# EasyEDA Pro project uicd.eprj, schematic UICD

## Sheets
1 Microcontroller: Board Name: UICD; Create Date: 2025-08-20; Page Name: Microcontroller; Project Name: uicd; Schematic Name: UICD; Update Date: 2025-09-17; Add into BOM: yes; Company: ООО "Центр ИКТ"; Convert to PCB: yes; Date: 06.10.2025; Draw By: varion drakonov & another; REV: 1.2; Sheet: 1/1; spicePre: .
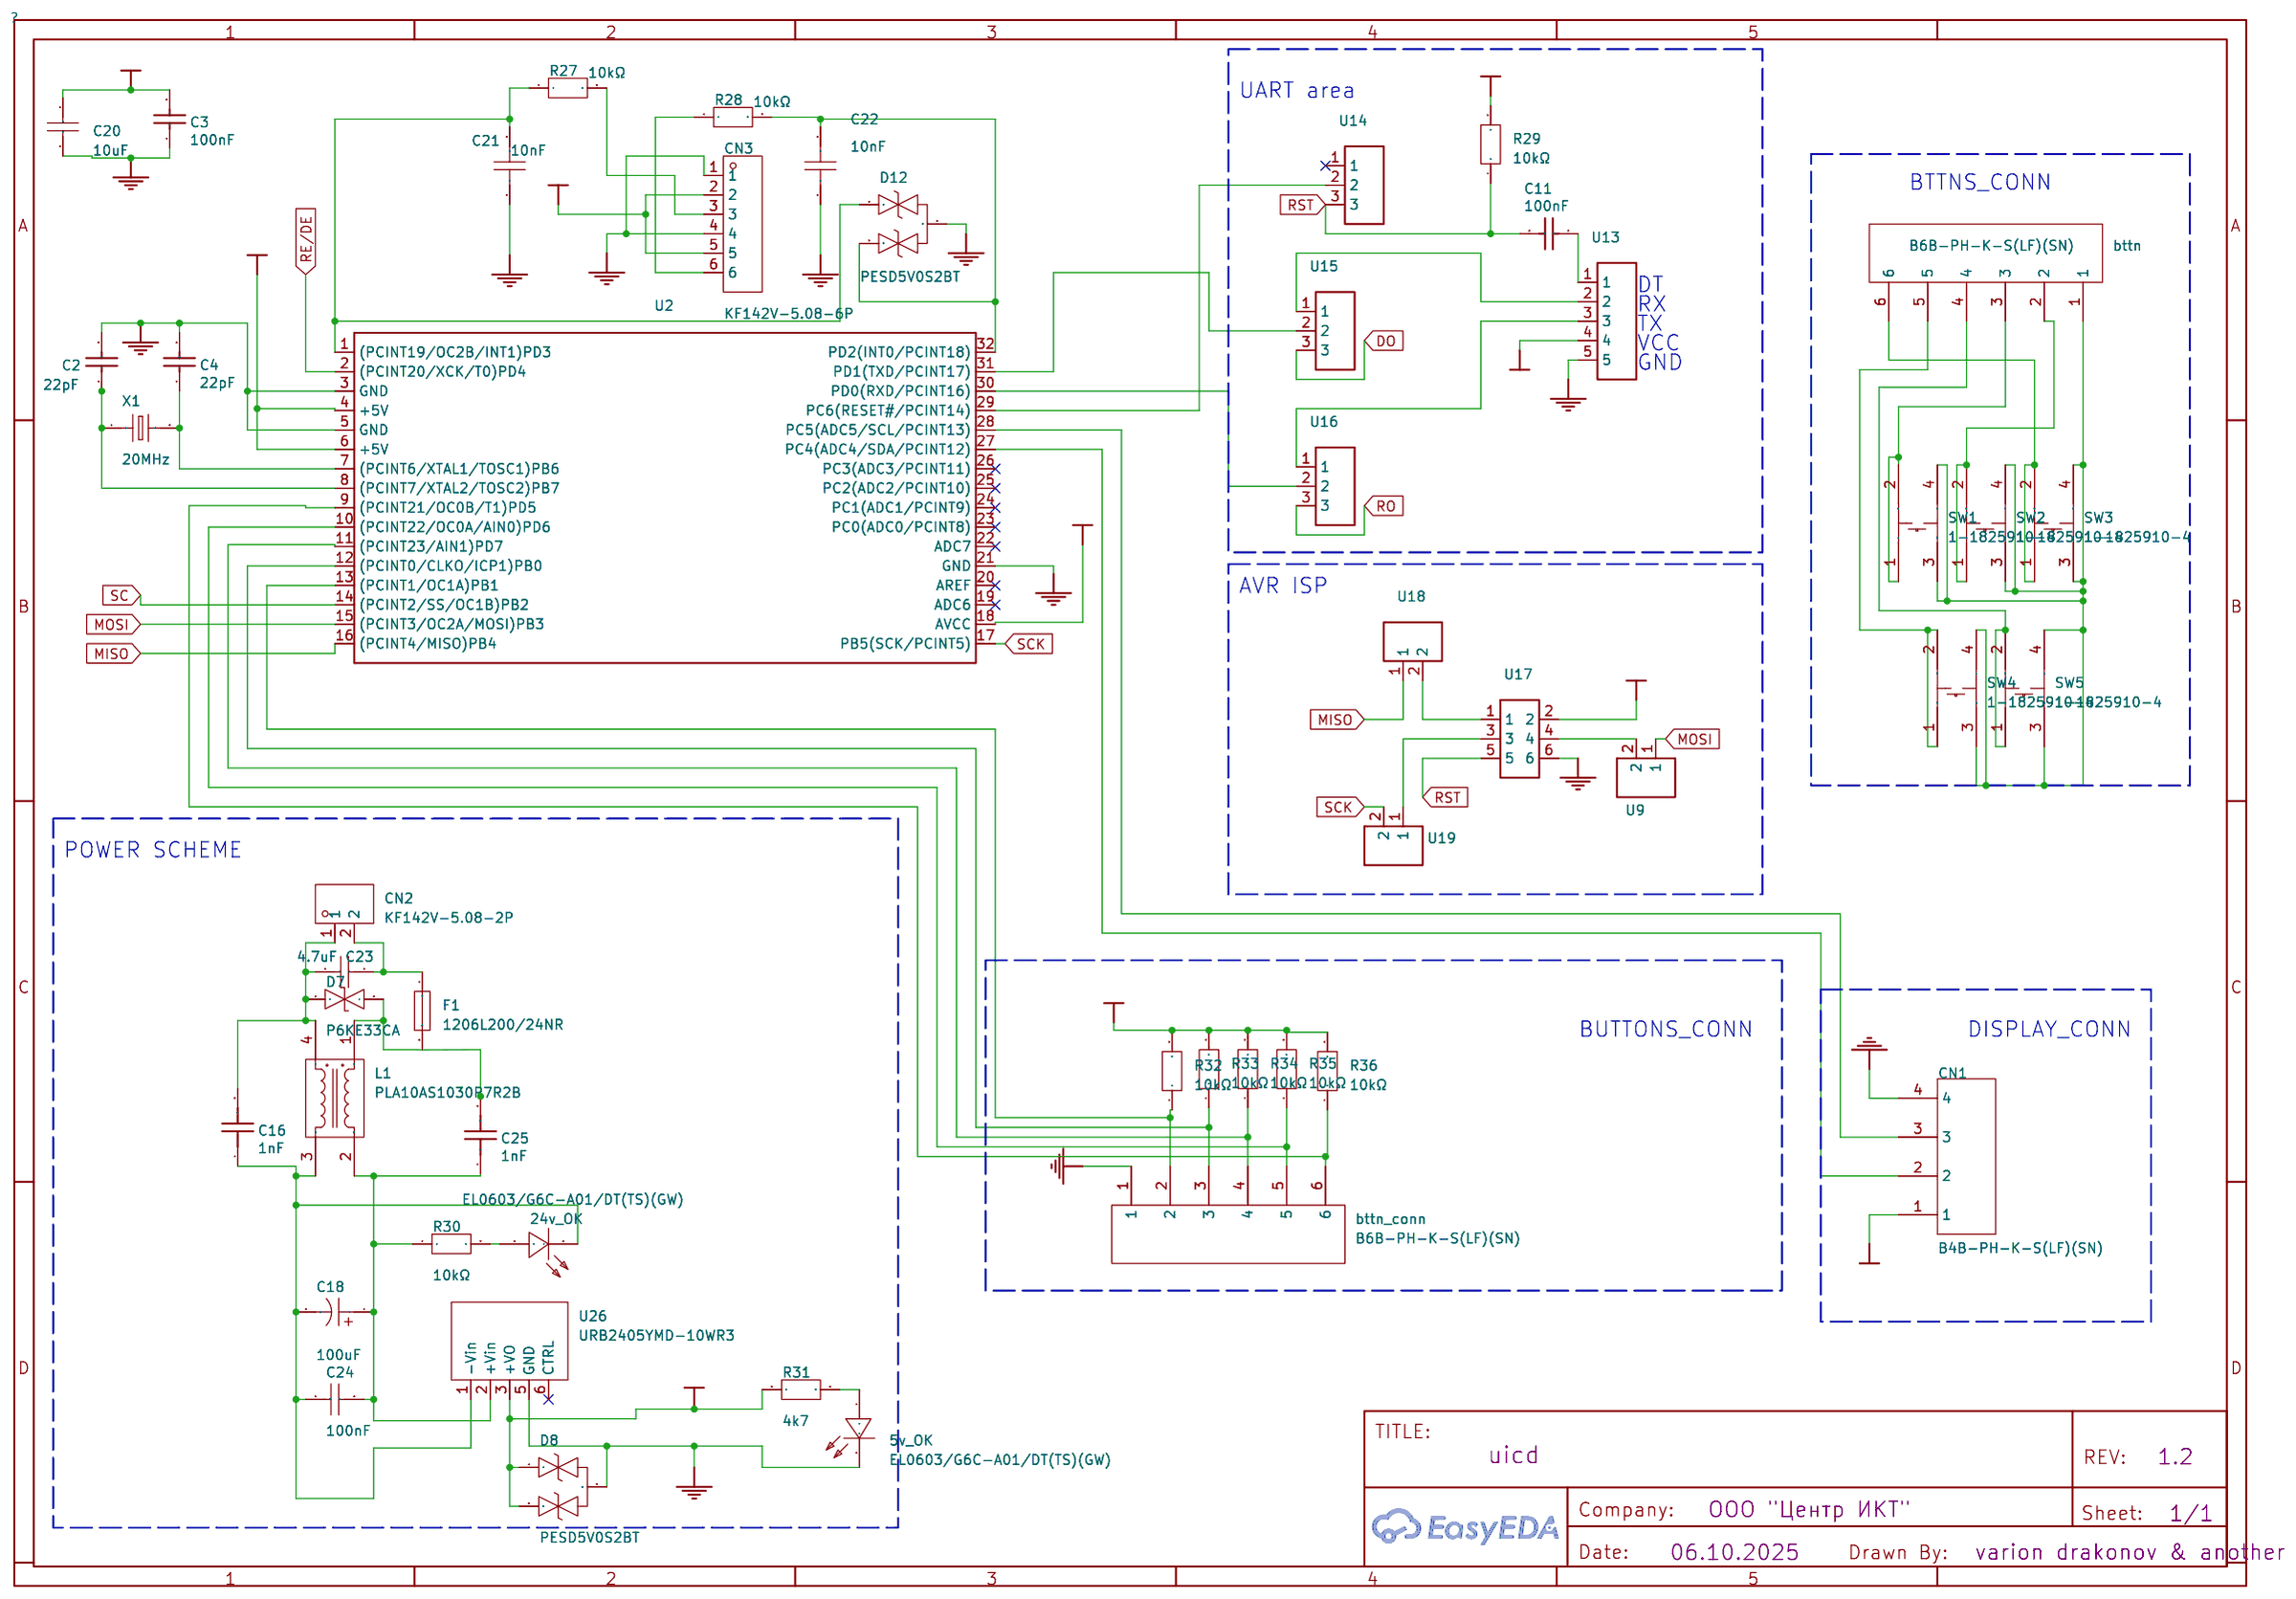
[diagram p0: Microcontroller]
2 MicroSD: Page Name: MicroSD; Update Date: 2025-09-04
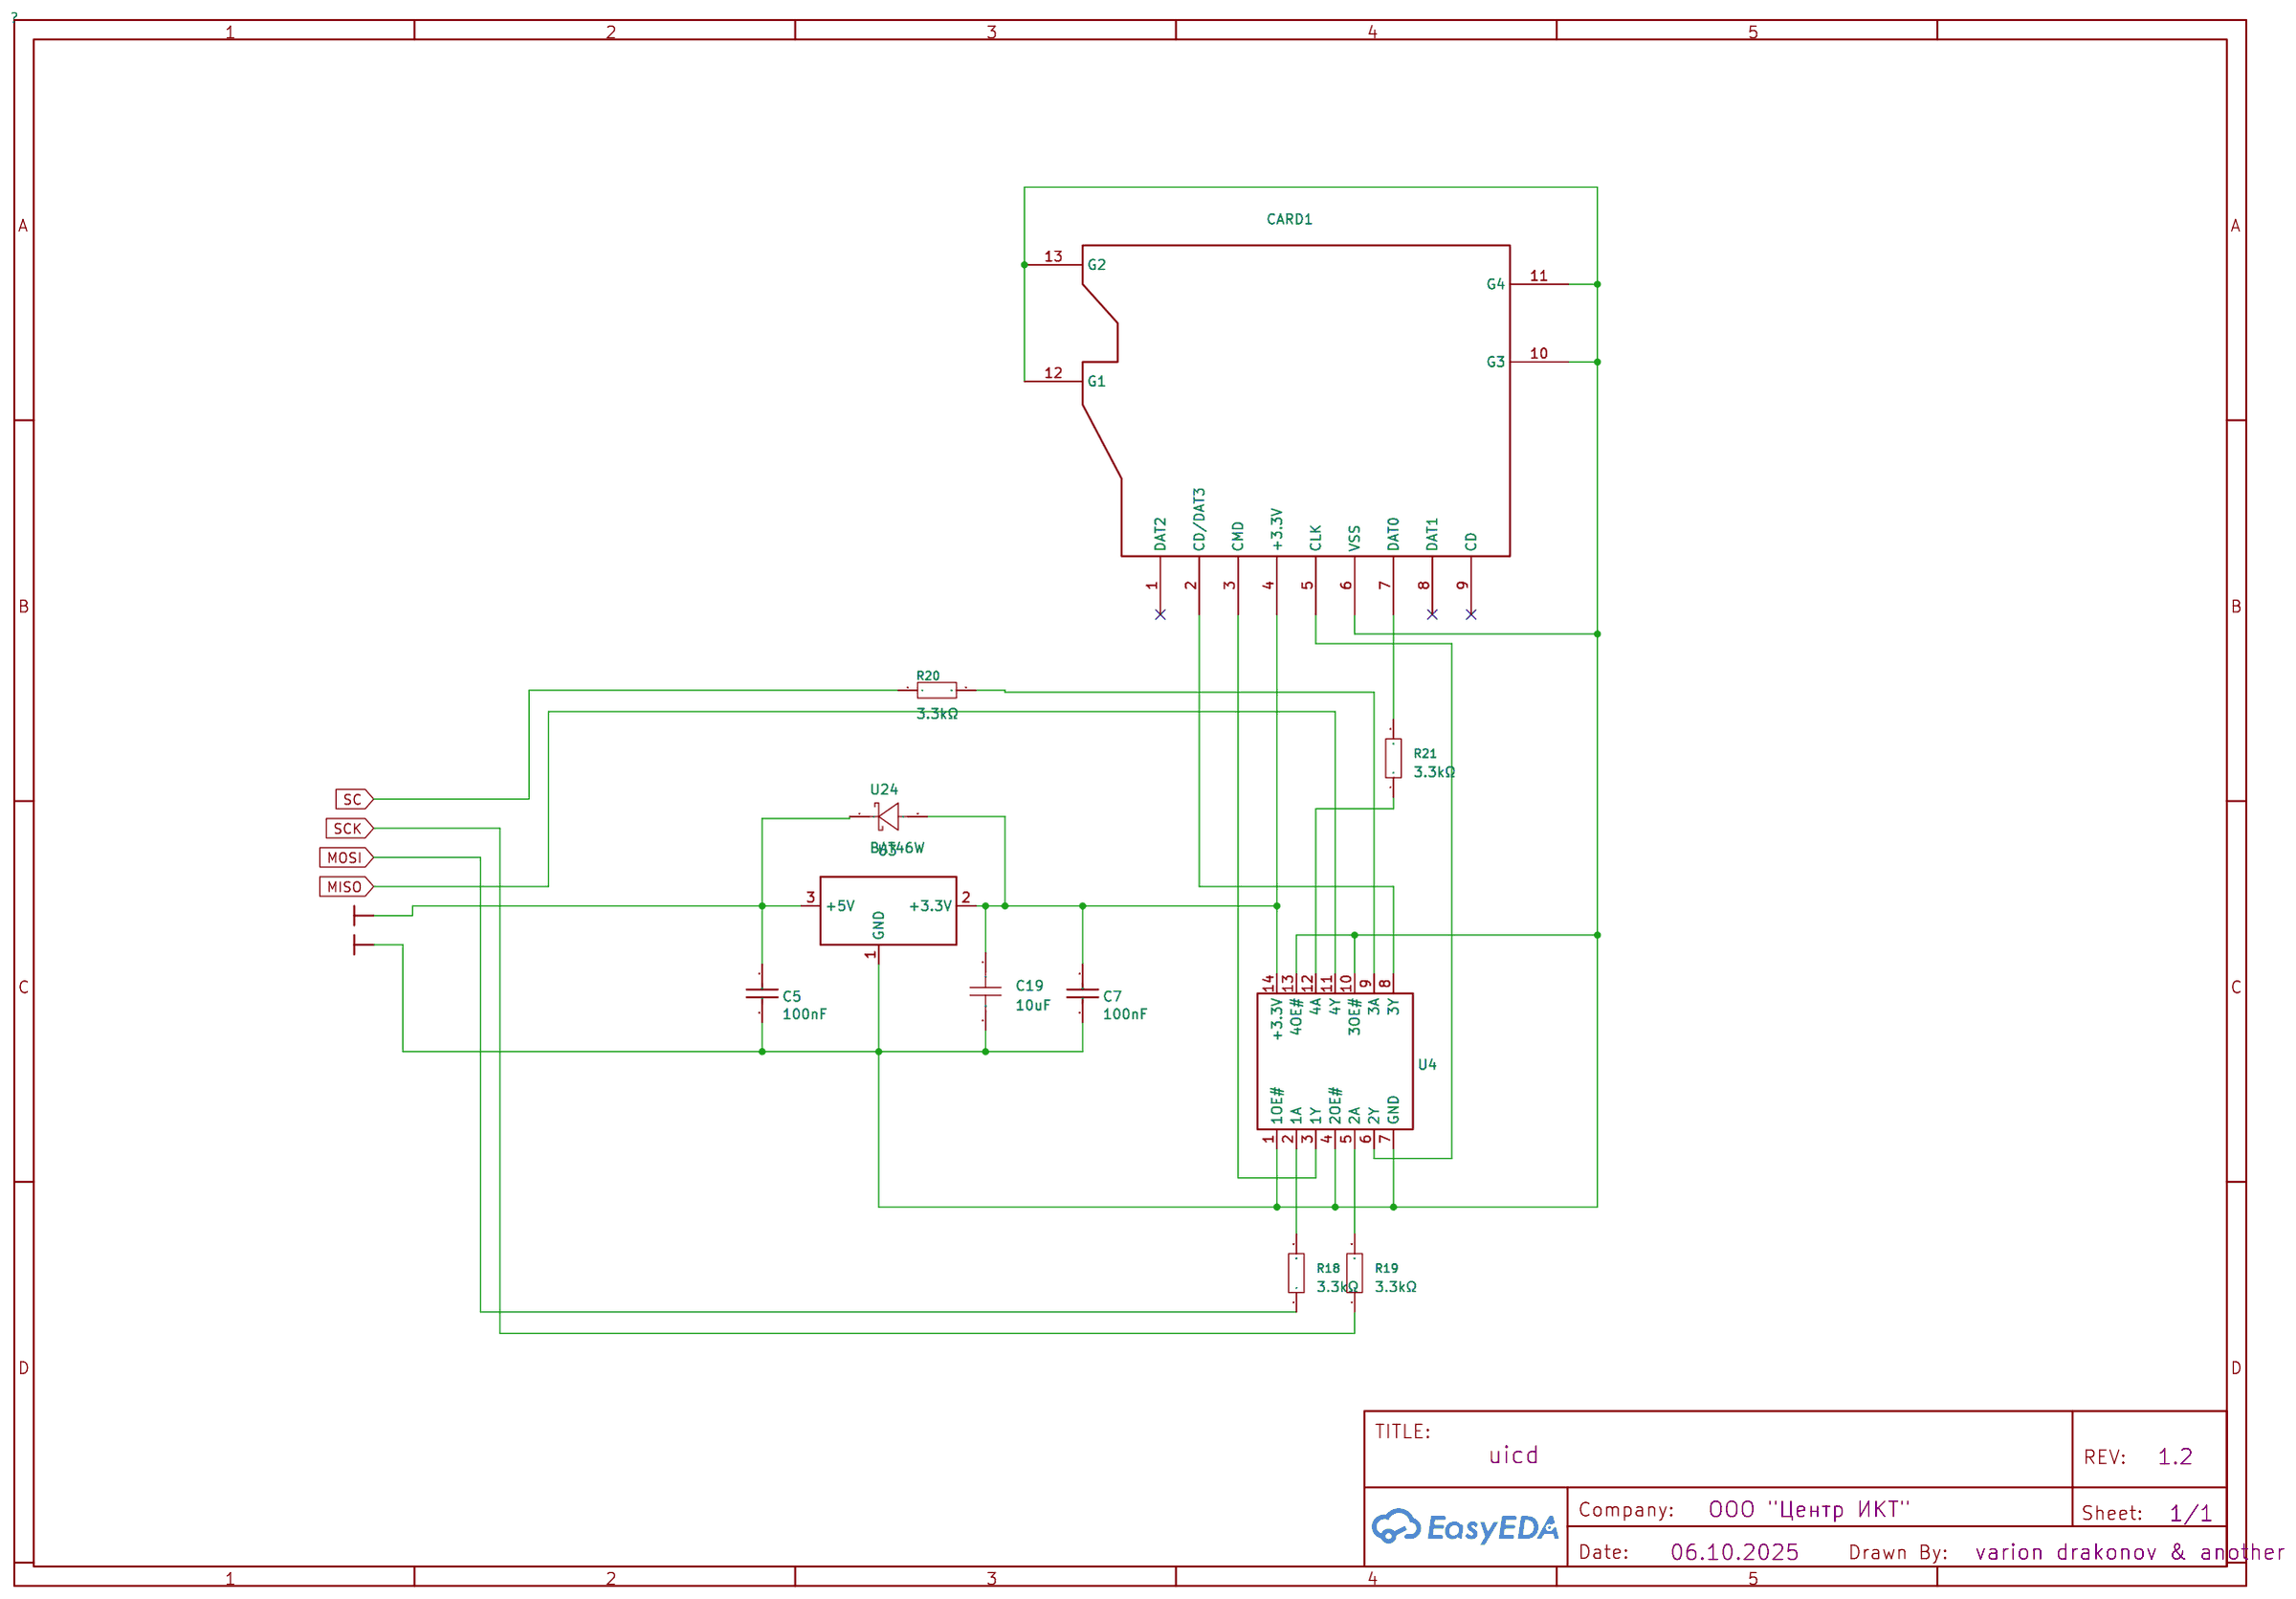
[diagram p1: MicroSD]
3 RS-485: Page Name: RS-485
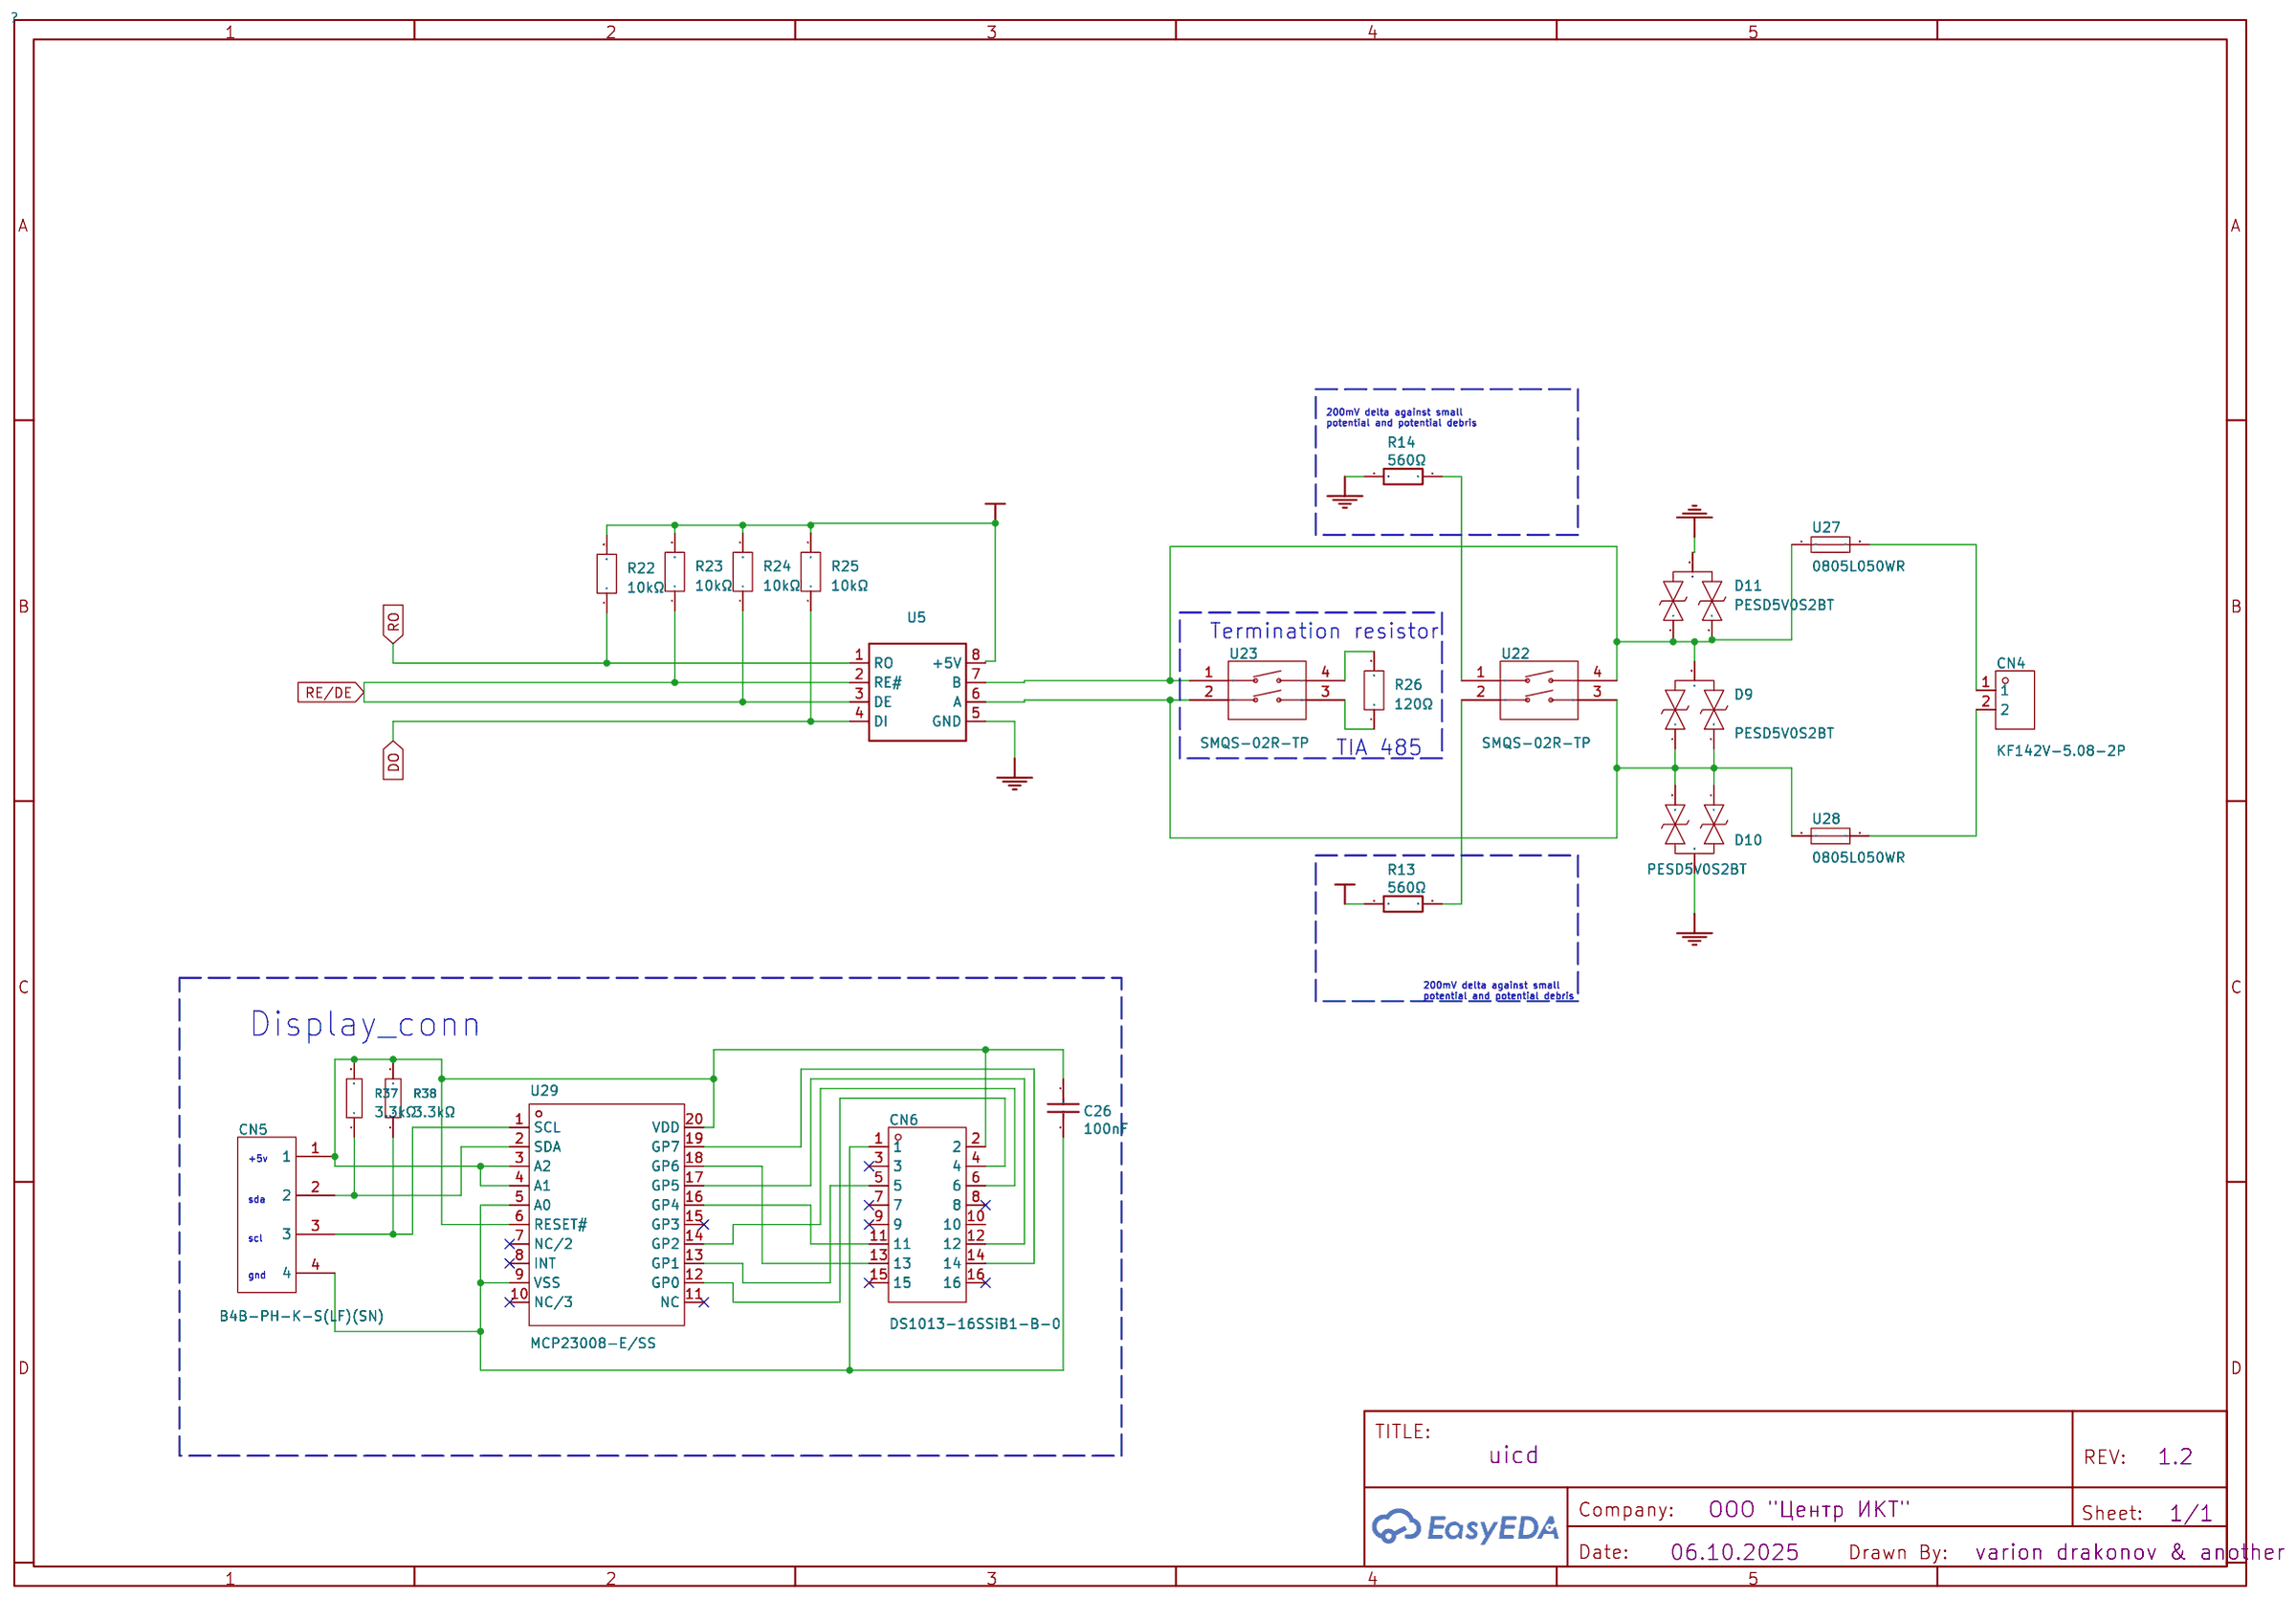
[diagram p2: RS-485]

## Parts
sheet Microcontroller
5v_OK  EL0603/G6C-A01/DT(TS)(GW)  [LED0603-R-RD_GREEN]
24v_OK  EL0603/G6C-A01/DT(TS)(GW)  [LED0603-R-RD_GREEN]
bttn  B6B-PH-K-S(LF)(SN)  [CONN-TH_B6B-PH-K-S]
bttn_conn  B6B-PH-K-S(LF)(SN)  [CONN-TH_B6B-PH-K-S]
C2  22pF  [C0603]
C3  100nF  [C0603]
C4  22pF  [C0603]
C11  100nF  [C0603]
C16  1nF  [C1206]
C18  100uF  [CAP-TH_BD8.0-P3.50-D0.5-FD]
C20  10uF  [C0603]
C21  10nF  [C0603]
C22  10nF  [C0603]
C23  4.7uF  [C1206]
C24  100nF  [C0603]
C25  1nF  [C1206]
CN1  B4B-PH-K-S(LF)(SN)  [CONN-TH_B4B-PH-K-S]
CN2  KF142V-5.08-2P  [CONN-TH_P5.08_KF142V-5.08-2P]
CN3  KF142V-5.08-6P  [CONN-TH_6P-P5.08_KF142V-5.08-6P]
D7  P6KE33CA  [DO-15_BD3.1-L6.7-P10.70-D0.9-BI]
D8  PESD5V0S2BT  [SOT-23-3_L2.9-W1.3-P1.90-LS2.4-BR]
D12  PESD5V0S2BT  [SOT-23-3_L2.9-W1.3-P1.90-LS2.4-BR]
F1  1206L200/24NR  [F1206]
L1  PLA10AS1030R7R2B  [FILTER-TH_PLA10AS1030R7R2B]
R27  10kΩ  [R0603]
R28  10kΩ  [R0603]
R29  10kΩ  [R0603]
R30  10kΩ  [R0603]
R31  4k7  [R0603]
R32  10kΩ  [R0603]
R33  10kΩ  [R0603]
R34  10kΩ  [R0603]
R35  10kΩ  [R0603]
R36  10kΩ  [R0603]
SW1  1-1825910-4  [KEY-TH_4P-L6.0-W6.0-P4.50-LS7.5]
SW2  1-1825910-4  [KEY-TH_4P-L6.0-W6.0-P4.50-LS7.5]
SW3  1-1825910-4  [KEY-TH_4P-L6.0-W6.0-P4.50-LS7.5]
SW4  1-1825910-4  [KEY-TH_4P-L6.0-W6.0-P4.50-LS7.5]
SW5  1-1825910-4  [KEY-TH_4P-L6.0-W6.0-P4.50-LS7.5]
U2  ATMEGA328-AU  [TQFP-32_L7.0-W7.0-P0.80-LS9.0-BL]
U9  DS1021-1x2SF11-B  [HDR-TH_2P-P2.54-V-M]
U13  DS1021-1x5SF11-B  [HDR-TH_5P-P2.54-V-M]
U14  DS1021-1x3SF11-B  [HDR-TH_3P-P2.54-V-M]
U15  DS1021-1x3SF11-B  [HDR-TH_3P-P2.54-V-M]
U16  DS1021-1x3SF11-B  [HDR-TH_3P-P2.54-V-M]
U17  DS1021-2x3SF11-B  [HDR-TH_6P-P2.54-V-M-R2-C3-S2.54]
U18  DS1021-1x2SF11-B  [HDR-TH_2P-P2.54-V-M]
U19  DS1021-1x2SF11-B  [HDR-TH_2P-P2.54-V-M]
U26  URB2405YMD-10WR3  [PWRM-TH_HI-LINK_URXXYMD-XXWR3]
X1  20MHz  [HC-49US_L11.5-W4.5-P4.88]
sheet MicroSD
C5  100nF  [C0603]
C7  100nF  [C0603]
C19  10uF  [C0603]
CARD1  TF-15x15  [TF-SMD_TF-15-15]
R18  3.3kΩ  [R0603]
R19  3.3kΩ  [R0603]
R20  3.3kΩ  [R0603]
R21  3.3kΩ  [R0603]
U3  AMS1117-3.3  [SOT-223-3_L6.5-W3.4-P2.30-LS7.0-BR-1]
U4  AIP74HC125  [SOP-14_L8.6-W3.9-P1.27-LS6.0-BL]
U24  BAT46W  [SOD-123_L2.8-W1.6-LS3.7-RD]
sheet RS-485
C26  100nF  [C0603]
CN4  KF142V-5.08-2P  [CONN-TH_P5.08_KF142V-5.08-2P]
CN5  B4B-PH-K-S(LF)(SN)  [CONN-TH_B4B-PH-K-S]
CN6  DS1013-16SSiB1-B-0  [IDC-TH_16P-P2.54_C3406]
D9  PESD5V0S2BT  [SOT-23-3_L2.9-W1.3-P1.90-LS2.4-BR]
D10  PESD5V0S2BT  [SOT-23-3_L2.9-W1.3-P1.90-LS2.4-BR]
D11  PESD5V0S2BT  [SOT-23-3_L2.9-W1.3-P1.90-LS2.4-BR]
R13  560Ω  [R0603]
R14  560Ω  [R0603]
R22  10kΩ  [R0603]
R23  10kΩ  [R0603]
R24  10kΩ  [R0603]
R25  10kΩ  [R0603]
R26  120Ω  [R0603]
R37  3.3kΩ  [R0603]
R38  3.3kΩ  [R0603]
U5  MAX485CSA+  [SOIC-8_L4.9-W3.9-P1.27-LS6.0-BL]
U22  SMQS-02R-TP  [SW-TH_4P-L9.9-W6.8-P7.62-BL]
U23  SMQS-02R-TP  [SW-TH_4P-L9.9-W6.8-P7.62-BL]
U27  0805L050WR  [R0805]
U28  0805L050WR  [R0805]
U29  MCP23008-E/SS  [SSOP-20_L7.2-W5.3-P0.65-LS7.8-BL]

## Library data of the parts
5v_OK 24v_OK = EL0603/G6C-A01/DT(TS)(GW): LCSC Part Name: 普绿/黄绿; Supplier Part: C1322294; Manufacturer: EVERLIGHT(亿光); Supplier Footprint: 0603; JLCPCB Part Class: Extended Part; Datasheet: https://atta.szlcsc.com/upload/public/pdf/source/20201221/C1322294_C0D439717A258E4D616F938F90961D42.pdf; Supplier: LCSC; Emitted Color: Yellow Green
bttn bttn_conn = B6B-PH-K-S(LF)(SN)_C131342: LCSC Part Name: 1x6P 间距:2mm 直插 系列:PH; Supplier Part: C131342; Manufacturer: JST; Supplier Footprint: 插件,P=2mm; JLCPCB Part Class: Extended Part; Datasheet: https://item.szlcsc.com/datasheet/B6B-PH-K-S(LF)(SN)/142635.html; Supplier: LCSC; Pins Structure: 1x6P; Pitch: 2mm; Mounting Type: Through Hole; Reference Series: PH; Number of Pins: 6P; Number of Rows: 1; Number of PINs Per Row: 6; Current Rating: 2A; Contact Material: Brass; Contact Plating: Tin; Operating Temperature: -25℃~+85℃; Voltage Rating: 100V; Plastic Material: PA66; Flame Retardant Rating: UL94V-0; Supplementary Features: K Pin; Color: White; Z-Height of the Board: 6mm; X-Length of Bottom Edge on Board (Spacing Line): 13.9mm; Y-Width of Bottom Edge on Board: 4.5mm
C2 C4 = 22pF: Supplier: LCSC; Manufacturer: muRata(村田); Manufacturer Part: GRM1555C1H220JA01D; Supplier Part: C76960; JLCPCB Part Class: Extended Part; nameAlias: Value; spicePre: C; spiceSymbolName: GRM188R71C104KA01D
C3 C7 C26 = CC0603KRX7R9BB104: Capacitance:100nF Tolerance:±10% Tolerance:±10% Voltage Rating:50V Temperature Coefficient:X7R; LCSC Part Name: 100nF ±10% 50V; Supplier Part: C14663; Manufacturer: YAGEO(国巨); Supplier Footprint: 0603; JLCPCB Part Class: Basic Part; Datasheet: https://item.szlcsc.com/datasheet/CC0603KRX7R9BB104/15331.html; Supplier: LCSC; Tolerance: ±10%; Voltage Rating: 50V; Temperature Coefficient: X7R
C11 = 0603F104M250: Capacitance:100nF Tolerance:±20% Tolerance:±20% Voltage Rating:25V Temperature Coefficient:Y5V; LCSC Part Name: 100nF ±20% 25V; Supplier Part: C125840; Manufacturer: Walsin(华新科); Supplier Footprint: 0603; JLCPCB Part Class: Extended Part; Datasheet: https://atta.szlcsc.com/upload/public/pdf/source/20191217/C469650_84AD5C6F618CF4AC0C6D987F2E8FE6F8.pdf; Supplier: LCSC; Tolerance: ±20%; Voltage Rating: 25V; Temperature Coefficient: Y5V
C16 C25 = 1206B102K202NT: Capacitance:1000pF Tolerance:±10% Tolerance:±10% Voltage Rating:2000V Temperature Coefficient:X7R; LCSC Part Name: 1nF ±10% 2kV; Supplier Part: C9196; Manufacturer: FH(风华); Supplier Footprint: 1206; JLCPCB Part Class: Basic Part; Datasheet: https://atta.szlcsc.com/upload/public/pdf/source/20200305/C486355_26A10D38EF8C2A5C37091D0039909270.pdf; Supplier: LCSC; Tolerance: ±10%; Voltage Rating: 2000V; Temperature Coefficient: X7R
C18 = 100UF50VF120GF: LCSC Part Name: 100uF ±20% 50V; Supplier Part: C46867072; Manufacturer: Econd(米朗电子); Supplier Footprint: 插件,D8xL12mm; Datasheet: https://atta.szlcsc.com/upload/public/pdf/source/20250321/B9ED006D79D4CBB252CF6B54793BD6AA.pdf; Supplier: LCSC; Tolerance: ±20%; Voltage Rating: 50V; Ripple Current: 550mA@100KHz; Equivalent Series Resistance(ESR): 170mΩ; Pin Spacing: 3.5mm; Diameter: 8mm; Height - Seated (Max): 12mm; Lifetime: 4000hrs@105℃; Operating Temperature: -40℃~+105℃
C20 = 0603X106K100: LCSC Part Name: 10uF ±10% 10V; Supplier Part: C90806; Manufacturer: Walsin(华新科); Supplier Footprint: 0603; JLCPCB Part Class: Extended Part; Datasheet: https://atta.szlcsc.com/upload/public/pdf/source/20191217/C469650_84AD5C6F618CF4AC0C6D987F2E8FE6F8.pdf; Supplier: LCSC; Tolerance: ±10%; Voltage Rating: 10V; Temperature Coefficient: X5R
C21 C22 = CT41G-0603-2X1-50V-0.01μF-K(N): LCSC Part Name: 10nF ±10% 50V; Supplier Part: C136131; Manufacturer: TORCH(火炬); Supplier Footprint: 0603; JLCPCB Part Class: Extended Part; Datasheet: https://atta.szlcsc.com/upload/public/pdf/source/20180104/C136131_15150388659201227415.pdf; Supplier: LCSC; Tolerance: ±10%; Voltage Rating: 50V
C23 = 12065C475KAT2A: LCSC Part Name: 4.7uF ±10% 50V; Supplier Part: C141667; Manufacturer: Kyocera AVX; Supplier Footprint: 1206; JLCPCB Part Class: Extended Part; Datasheet: https://atta.szlcsc.com/upload/public/pdf/source/20171113/C141667_15105613327821115823.pdf; Supplier: LCSC; Tolerance: ±10%
C24 = CT41G-0603-2X1-50V-0.1μF-K(N): LCSC Part Name: 100nF ±10% 50V; Supplier Part: C125205; Manufacturer: TORCH(火炬); Supplier Footprint: 0603; JLCPCB Part Class: Extended Part; Datasheet: https://atta.szlcsc.com/upload/public/pdf/source/20171225/C150708_15141883600121203188.pdf; Supplier: LCSC; Tolerance: ±10%; Voltage Rating: 50V
CN1 CN5 = B4B-PH-K-S(LF)(SN)_C131334: LCSC Part Name: 1x4P 间距:2mm 直插 系列:PH; Supplier Part: C131334; Manufacturer: JST; Supplier Footprint: 插件,P=2mm; JLCPCB Part Class: Extended Part; Datasheet: https://item.szlcsc.com/datasheet/B4B-PH-K-S(LF)(SN)/142627.html; Supplier: LCSC; Pins Structure: 1x4P; Pitch: 2mm; Mounting Type: Through Hole; Reference Series: PH; Number of Pins: 4P; Number of Rows: 1; Number of PINs Per Row: 4; Current Rating: 2A; Contact Material: Brass; Contact Plating: Tin; Operating Temperature: -25℃~+85℃; Voltage Rating: 100V; Plastic Material: PA66; Flame Retardant Rating: UL94V-0; Supplementary Features: K Pin; Color: White; Z-Height of the Board: 6mm; X-Length of Bottom Edge on Board (Spacing Line): 9.9mm; Y-Width of Bottom Edge on Board: 4.5mm
CN2 CN4 = KF142V-5.08-2P: LCSC Part Name: 5.08mm 每排P数:2; Supplier Part: C475134; Manufacturer: KEFA(科发); Supplier Footprint: 插件,P=5.08mm; JLCPCB Part Class: Extended Part; Datasheet: https://atta.szlcsc.com/upload/public/pdf/source/20230317/1DB2597711F659A3F077BF3D01BF6429.pdf; Supplier: LCSC; Pitch: 5.08mm; Number of Pins: 2P; Number of PINs Per Row: 2; Current Rating (Max): 15A; Voltage Rating (Max): 250V; Wire Gauge - AWG: 14~22; Wire Gauge - mm2: 1.5
CN3 = KF142V-5.08-6P: LCSC Part Name: 5.08mm 每排P数:6; Supplier Part: C475138; Manufacturer: KEFA(科发); Supplier Footprint: 插件,P=5.08mm; JLCPCB Part Class: Extended Part; Datasheet: https://atta.szlcsc.com/upload/public/pdf/source/20230317/1DB2597711F659A3F077BF3D01BF6429.pdf; Supplier: LCSC; Pitch: 5.08mm; Number of Pins: 6P; Number of PINs Per Row: 6; Current Rating (Max): 15A; Voltage Rating (Max): 250V; Wire Gauge - AWG: 14~22; Wire Gauge - mm2: 1.5
D7 = P6KE33CA_C280388: LCSC Part Name: 双向TVS 28.2V截止 13.1A峰值脉冲; Supplier Part: C280388; Manufacturer: GOOD-ARK(固锝); Supplier Footprint: DO-15; JLCPCB Part Class: Extended Part; Datasheet: https://item.szlcsc.com/datasheet/P6KE33CA/267188.html; Supplier: LCSC; Reverse Stand-Off Voltage (Vrwm): 28.2V; Clamping Voltage: 45.7V; Peak Pulse Current (Ipp): 13.1A; Peak Pulse Power Dissipation (Ppp): 600W; Voltage - Breakdown: 31.4V; Reverse Leakage Current (Ir): 1uA; Type: TVS
D8-D12 = PESD5V0S2BT_C28310457: LCSC Part Name: 双向ESD 5V截止 峰值脉冲电流：16A; Supplier Part: C28310457; Manufacturer: GOODWORK(固得沃克); Supplier Footprint: SOT-23; JLCPCB Part Class: Extended Part; Datasheet: https://item.szlcsc.com/datasheet/PESD5V0S2BT/30046927.html; Supplier: LCSC; Polarity: Bidirectional; Reverse Stand-Off Voltage (Vrwm): 5V; Clamping Voltage: 11V; Peak Pulse Current (Ipp): 16A; Peak Pulse Power Dissipation (Ppp): 250W; Voltage - Breakdown: 6V; Reverse Leakage Current (Ir): 10nA; Number of Channels: 2; Operating Temperature: -55℃~+125℃; level of protection: IEC 61000-4-4；IEC 61000-4-2; Type: ESD; Junction Capacitance: 35pF
F1 = 1206L200/24NR: LCSC Part Name: 24V 2.00A 1206 自恢复; Supplier Part: C42396578; Manufacturer: LUTE(陆特); Supplier Footprint: 1206; JLCPCB Part Class: Extended Part; Datasheet: https://item.szlcsc.com/datasheet/1206L200%252F24NR/44344788.html; Supplier: LCSC; Voltage - Max: 24V; Current - Max: 40A; Hold Current: 2A; Trip Current: 3.5A; Power Dissipation: 1.2W; Resistance - Initial (Ri) (Min): 15mΩ; Resistance - Post Trip (R1) (Max): 80mΩ; Time to Trip(Max): 1.5s; Operating Temperature: -40℃~+85℃; Length: 3.6mm; Width: 1.9mm; Height: 1.6mm
L1 = PLA10AS1030R7R2B: LCSC Part Name: 两路 插件共模滤波器; Supplier Part: C184805; Manufacturer: muRata(村田); Supplier Footprint: 插件; JLCPCB Part Class: Extended Part; Datasheet: https://atta.szlcsc.com/upload/public/pdf/source/20180530/C184805_CE80C580E88E53863865C4B8BAC5CFEC.pdf; Supplier: LCSC; Number of Lines: 2; Withstanding Voltage: 80V; Current Rating: 700mA; Voltage Rating - DC: 250V; DC Resistance (DCR): 860mΩ; Operating Temperature: -25℃~60℃
R22-R25 R27-R29 = RMC 0603 10K J N: Supplier Part: C5362358; Manufacturer: Tyohm(幸亚电阻); Supplier Footprint: 0603; JLCPCB Part Class: Extended Part; Datasheet: https://item.szlcsc.com/datasheet/RMC%25200603%252010K%2520J%2520N/6187172.html; Supplier: LCSC; Type: Thick Film Resistor; Tolerance: ±5%; Power(Watts): 100mW; Voltage-Supply(Max): 50V; Temperature Coefficient: ±100ppm/℃; Operating Temperature: -55℃~+155℃
R30-R36 = CRG0603J10K: LCSC Part Name: 厚膜电阻 10kΩ ±5% 100mW; Supplier Part: C2073745; Manufacturer: TE Connectivity(泰科电子); Supplier Footprint: 0603; JLCPCB Part Class: Extended Part; Datasheet: https://atta.szlcsc.com/upload/public/pdf/source/20210608/D95D7196C11938F01E5013E79A9A3DFC.pdf; Supplier: LCSC; Type: Thick Film Resistor; Tolerance: ±5%; Power(Watts): 100mW; Voltage-Supply(Max): 75V; Temperature Coefficient: ±200ppm/℃; Operating Temperature: -55℃~+155℃
SW1-SW5 = 1-1825910-4: LCSC Part Name: 5.99*5.99*9.5mm 直插 轻触开关; Supplier Part: C589907; Manufacturer: TE Connectivity(泰科电子); Supplier Footprint: 插件; JLCPCB Part Class: Extended Part; Datasheet: https://item.szlcsc.com/datasheet/1-1825910-4/617803.html; Supplier: LCSC; Circuit: SPST; Actuator Style: Round Button; Operating Force: 1.6N; Mounting Type: Through Hole; Length: 5.99mm; Width: 5.99mm; Switch Height: 9.5mm; with Bracket: Without Bracket; Contact Current: 50mA; Voltage Rating: 24V; Actuator/Cap Color: Black; Termination Style: PC Pin; Operating Temperature: -35℃~+85℃
U2 = ATMEGA328-AU_C618731: CPU Core:AVR CPU Maximum Speed:20MHz Program Storage Size:32KB Number of I/O:23 ADC (Bit):10bit Voltage - Supply:1.8V~5.5V Voltage - Supply:1.8V~5.5V Applications:-; LCSC Part Name: 基于AVR增强型RISC架构的低功耗CMOS 8位微控制器; Supplier Part: C618731; Manufacturer: MICROCHIP(美国微芯); Supplier Footprint: TQFP-32(7x7); JLCPCB Part Class: Extended Part; Datasheet: https://atta.szlcsc.com/upload/public/pdf/source/20210120/C618731_4D5D0A4E4A90583AD8C10127665CE8F9.pdf; Supplier: LCSC; CPU Core: AVR; CPU Maximum Speed: 20MHz; Program Storage Size: 32KB; Number of I/O: 23; ADC (Bit): 10bit; Voltage - Supply: 1.8V~5.5V
U9 U18 U19 = DS1021-1x2SF11-B: Pin Structure:1x2P Pitch:2.54mm Mounting Type:Through Hole Number of Rows:1 Number of Pins:2P; LCSC Part Name: 1x2P 间距:2.54mm 直插; Supplier Part: C7430358; Manufacturer: CONNFLY; Supplier Footprint: 插件,P=2.54mm; JLCPCB Part Class: Extended Part; Datasheet: https://item.szlcsc.com/datasheet/DS1021-1x2SF11-B/8430011.html; Supplier: LCSC; Pin Structure: 1x2P; Pitch: 2.54mm; Mounting Type: Through Hole; Number of Rows: 1; Number of Pins: 2P
U13 = DS1021-1x5SF11-B: Pin Structure:1x5P Pitch:2.54mm Mounting Type:Straight Number of Rows:Single Row Number of Pins:5P; LCSC Part Name: 1x5P 间距:2.54mm 直插; Supplier Part: C7430361; Manufacturer: CONNFLY; Supplier Footprint: 插件,P=2.54mm; JLCPCB Part Class: Extended Part; Datasheet: https://atta.szlcsc.com/upload/public/pdf/source/20241114/27FAEF0E91163947C2CEC0E4F5C2DBE0.pdf; Supplier: LCSC; Pin Structure: 1x5P; Pitch: 2.54mm; Mounting Type: Straight; Number of Rows: Single Row; Number of Pins: 5P
U14-U16 = DS1021-1x3SF11-B: Pin Structure:1x3P Pitch:2.54mm Mounting Type:Straight Number of Rows:Single Row Number of Pins:3P; LCSC Part Name: 1x3P 间距:2.54mm 直插; Supplier Part: C7430359; Manufacturer: CONNFLY; Supplier Footprint: 插件,P=2.54mm; JLCPCB Part Class: Extended Part; Datasheet: https://atta.szlcsc.com/upload/public/pdf/source/20241114/ED9D1FB51BE67CF087A875AE5E257FDB.pdf; Supplier: LCSC; Pin Structure: 1x3P; Pitch: 2.54mm; Mounting Type: Straight; Number of Rows: Single Row; Number of Pins: 3P
U17 = DS1021-2x3SF11-B: Pin Structure:2x3P Pitch:2.54mm Mounting Type:Through Hole Number of Rows:2 Number of Pins:6P; LCSC Part Name: 2x3P 间距:2.54mm 直插; Supplier Part: C7430399; Manufacturer: CONNFLY; Supplier Footprint: 插件,P=2.54mm; JLCPCB Part Class: Extended Part; Datasheet: https://item.szlcsc.com/datasheet/DS1021-2x3SF11-B/8430052.html; Supplier: LCSC; Pin Structure: 2x3P; Pitch: 2.54mm; Mounting Type: Through Hole; Number of Rows: 2; Number of Pins: 6P
U26 = URB2405YMD-10WR3_C5183120: LCSC Part Name: 直流隔离电源模块24V转5V短路保护; Supplier Part: C5183120; Manufacturer: HI-LINK(海凌科); Supplier Footprint: 插件; JLCPCB Part Class: Extended Part; Datasheet: https://atta.szlcsc.com/upload/public/pdf/source/20220927/3A9D2C05C340770B5C03D80750AABC5E.pdf; Supplier: LCSC; Output Power: 10W; Voltage - Supply: 9V~36V; Output Voltage: 5V; Output Current(Max): 2A; Isolation Voltage(Vrms): 1500V; Features: Short-Circuit  Protection
X1 = XIHCELNANF-20MHZ: LCSC Part Name: 20MHz ±30ppm 20pF; Supplier Part: C295076; Manufacturer: TAITIEN(泰艺电子); Supplier Footprint: HC-49S; JLCPCB Part Class: Extended Part; Datasheet: https://atta.szlcsc.com/upload/public/pdf/source/20190107/C358649_B3943D1FEB8737E4FCE005A191A94016.pdf; Supplier: LCSC; Type: Through-Hole Crystal Oscillator; Normal temperature Frequency Tolerance: ±30ppm; Load Capacitance: 20pF; Frequency Stability: ±30ppm; Operating Temperature: -40℃~+85℃
C5 = 100nF: Supplier: LCSC; Manufacturer: muRata(村田); Manufacturer Part: GRM188R71C104KA01D; Supplier Part: C45000; JLCPCB Part Class: Extended Part; nameAlias: Value; spicePre: C; spiceSymbolName: GRM188R71C104KA01D
C19 = 0603X106K100CT: LCSC Part Name: 10uF ±10%; Supplier Part: C2840513; Manufacturer: Walsin(华新科); Supplier Footprint: 0603; JLCPCB Part Class: Extended Part; Datasheet: https://atta.szlcsc.com/upload/public/pdf/source/20210707/C2840513_FC43A2A62BF29FBE407BBABA9C1F0793.pdf; Supplier: LCSC; Tolerance: ±10%; Temperature Coefficient: X5R
CARD1 = TF-15x15: Card Connection Mode:Self-bouncing Card Type:MicroSD card (TF card) Connector Type:Card Slot Additional Card Detection Pins:Yes Height Above Board:2mm Operating Temperature:-25℃~+85℃ Operating Temperature:-25℃~+85℃; LCSC Part Name: 自弹式 MicroSD卡(TF卡) 卡座; Supplier Part: C111196; Manufacturer: SOFNG(硕方); Supplier Footprint: SMD; JLCPCB Part Class: Extended Part; Datasheet: https://atta.szlcsc.com/upload/public/pdf/source/20200911/C111196_6985EA70490FD8F56A5C3F4D017F3786.pdf; Supplier: LCSC; Card Connection Mode: Self-bouncing; Card Type: MicroSD card (TF card); Connector Type: Card Slot; Additional Card Detection Pins: Yes; Height Above Board: 2mm; Operating Temperature: -25℃~+85℃
R18-R21 R37 R38 = RMC06033.3K1%N: LCSC Part Name: 3.3kΩ ±1% 100mW; Supplier Part: C269710; Manufacturer: Tyohm(幸亚电阻); Supplier Footprint: 0603; JLCPCB Part Class: Extended Part; Datasheet: https://item.szlcsc.com/datasheet/RMC06033.3K1%2525N/259150.html; Supplier: LCSC; Tolerance: ±1%; Power(Watts): 0.1W
U3 = AMS1117-3.3_C22459274: Supplier Part: C22459274; Manufacturer: 晶扬电子; Supplier Footprint: SOT-223; JLCPCB Part Class: Extended Part; Datasheet: https://atta.szlcsc.com/upload/public/pdf/source/20240614/13D5BBC0BD58A3E0B7718A2940492C2C.pdf; Supplier: LCSC; Output Type: Fixed; Output Voltage: 3.3V; Output Current: 1A; Power Supply Rejection Ratio (PSRR): 60dB@(120Hz); Features: 热关断(TSD)；Overcurrent Protection(OCP); Operating Temperature: -40℃~+125℃; Output Configuration: Positive electrode; Number of Outputs: 1
U4 = AIP74HC125: Operating Temperature:-40℃~+85℃ Operating Temperature:-40℃~+85℃; Supplier Part: C93012; Manufacturer: I-CORE(中微爱芯); Supplier Footprint: SOP-14; JLCPCB Part Class: Extended Part; Datasheet: https://item.szlcsc.com/datasheet/AIP74HC125/94207.html; Supplier: LCSC; Operating Temperature: -40℃~+85℃
U24 = BAT46W_C5189259: LCSC Part Name: 电压:100V 电流:150mA; Supplier Part: C5189259; Manufacturer: TWGMC(台湾迪嘉); Supplier Footprint: SOD-123; JLCPCB Part Class: Extended Part; Datasheet: https://item.szlcsc.com/datasheet/BAT46W/5867311.html; Supplier: LCSC; Diode Configuration: 1 Independent; Voltage - Forward(Vf@If): 1V@250mA; Voltage - DC Reverse(Vr): 100V; Current - Rectified: 150mA; Reverse Leakage Current (Ir): 5uA; Non-Repetitive Peak Forward Surge Current: 750mA
CN6 = DS1013-16SSiB1-B-0: LCSC Part Name: 间距:2.54mm 直插; Supplier Part: C7430313; Manufacturer: CONNFLY; Supplier Footprint: P=2.54mm; JLCPCB Part Class: Extended Part; Datasheet: https://item.szlcsc.com/datasheet/DS1013-16SSiB1-B-0/8429947.html; Supplier: LCSC; Pitch: 2.54mm; Mounting Type: Through Hole
R13 R14 = 560Ω: Supplier: LCSC; Manufacturer: LIZ(丽智电子); Manufacturer Part: CR0603JA0561G; Supplier Part: C101367; JLCPCB Part Class: Extended Part; nameAlias: Value; spicePre: R; spiceSymbolName: CR0603JA0561G
R26 = CRCW0603120RFKEA: LCSC Part Name: 厚膜电阻 120Ω ±1% 100mW; Supplier Part: C844736; Manufacturer: VISHAY(威世); Supplier Footprint: 0603; JLCPCB Part Class: Extended Part; Datasheet: https://atta.szlcsc.com/upload/public/pdf/source/20200927/C844919_23E7F5DF28E9421F105631C5C2D28736.pdf; Supplier: LCSC; Type: Thick Film Resistors; Tolerance: ±1%; Temperature Coefficient: ±100ppm/℃; Operating Temperature Range: -55℃~+155℃
U5 = MAX485CSA+: Type:transceiver Number of Drivers:1 Number of Receivers:1 Voltage - Supply:4.75V~5.25V Voltage - Supply:4.75V~5.25V Data Rate:2.5Mbps Data Rate:2.5Mbps Operating Temperature:0℃~+70℃ Operating Temperature:0℃~+70℃; LCSC Part Name: 低功耗、限摆率、RS-485/RS-422收发器; Supplier Part: C143494; Manufacturer: ADI(亚德诺)/MAXIM(美信); Supplier Footprint: SOIC-8; JLCPCB Part Class: Extended Part; Datasheet: https://item.szlcsc.com/datasheet/MAX485CSA%252B/154825.html; Supplier: LCSC; Type: transceiver; Number of Drivers: 1; Number of Receivers: 1; Voltage - Supply: 4.75V~5.25V; Data Rate: 2.5Mbps; Operating Temperature: 0℃~+70℃
U22 U23 = SMQS-02R-TP: LCSC Part Name: 间距2.54mm 平拨,凸起式2位拨码开关; Supplier Part: C5299503; Manufacturer: SM Switch; JLCPCB Part Class: Extended Part; Datasheet: https://atta.szlcsc.com/upload/public/pdf/source/20230428/BECBF613F67C0CF733CC6E01F0CA4E67.pdf; Supplier: LCSC; Type: 平拨,凸起式; Number of Positions: 2Bit; Lead Pitch: 2.54mm; Operating Temperature: -40℃~+85℃; Operating Life: 5千次; Color: Red
U27 U28 = 0805L050WR: LCSC Part Name: 6V 500mA 0805自恢复; Supplier Part: C207022; Manufacturer: Littelfuse(美国力特); Supplier Footprint: 0805; JLCPCB Part Class: Extended Part; Datasheet: https://item.szlcsc.com/datasheet/0805L050WR/208141.html; Supplier: LCSC; Voltage - Max: 6V; Current - Max: 100A; Hold Current: 500mA; Trip Current: 1A; Resistance - Initial (Ri) (Min): 150mΩ; Resistance - Post Trip (R1) (Max): 850mΩ; Time to Trip(Max): 100ms; Operating Temperature: -40℃~+85℃; Length: 2.2mm; Width: 1.5mm; Height: 1.25mm
U29 = MCP23008-E/SS: LCSC Part Name: 8位I/O扩展器带串行接口; Supplier Part: C148011; Manufacturer: MICROCHIP(美国微芯); Supplier Footprint: SSOP-20-208mil; JLCPCB Part Class: Extended Part; Datasheet: https://atta.szlcsc.com/upload/public/pdf/source/20171228/C152205_15144475388971215001.pdf; Supplier: LCSC; Interface: I2C; Number of I/O: 8; Interrupt Output: With Interrupt Output; Clock Frequency: 1.7MHz

## Nets
+5V: C3.2 C5.2 C20.2 CN1.1 CN3.2 CN3.5 D8.1 D8.2 R13.1 R22.2 R23.2 R24.2 R25.2 R29.2 R31.1 R32.2 R33.2 R34.2 R35.2 R36.2 U2.4(+5V) U2.6(+5V) U2.18(AVCC) U3.3(+5V) U5.8(+5V) U13.4 U17.2 U24.1(K) U26.3(+VO)
GND: 5v_OK.2(K) bttn_conn.1 C2.2 C3.1 C4.2 C5.1 C7.1 C19.2 C20.1 C21.1 C22.1 CARD1.6(VSS) CARD1.10(G3) CARD1.11(G4) CARD1.12(G1) CARD1.13(G2) CN1.4 CN3.1 CN3.4 D8.3 D10.3 D11.3 D12.3 R14.2 U2.3(GND) U2.5(GND) U2.21(GND) U3.1(GND) U4.1(1OE#) U4.4(2OE#) U4.7(GND) U4.10(3OE#) U4.13(4OE#) U5.5(GND) U13.5 U17.6 U26.5(GND)
DO: R25.1 U5.4(DI) U15.3
MISO: U2.16((PCINT4/MISO)PB4) U4.11(4Y) U18.1
MOSI: R18.1 U2.15((PCINT3/OC2A/MOSI)PB3) U9.1
RE/DE: R23.1 R24.1 U2.2((PCINT20/XCK/T0)PD4) U5.2(RE#) U5.3(DE)
RO: R22.1 U5.1(RO) U16.3
RST: C11.2 R29.1 U14.3 U17.5
SC: R20.1 U2.14((PCINT2/SS/OC1B)PB2)
SCK: R19.1 U2.17(PB5(SCK/PCINT5)) U19.2
$1N1: C4.1 U2.7((PCINT6/XTAL1/TOSC1)PB6) X1.2
$1N2: C2.1 U2.8((PCINT7/XTAL2/TOSC2)PB7) X1.1
$1N5: U2.30(PD0(RXD/PCINT16)) U16.2
$1N14: U13.3 U16.1
$1N15: U13.2 U15.1
$1N21: C11.1 U13.1
$1N22: U2.29(PC6(RESET#/PCINT14)) U14.2
$1N25: U9.2 U17.4
$1N27: U17.1 U18.2
$1N28: U17.3 U19.1
$1N40: C21.2 D12.1 R27.1 U2.1((PCINT19/OC2B/INT1)PD3)
$1N1591: CN3.3 R27.2
$1N2127: CN1.3 U2.28(PC5(ADC5/SCL/PCINT13))
$1N2135: CN1.2 U2.27(PC4(ADC4/SDA/PCINT12))
$1N8792: 24v_OK.2(K) C16.1 C18.2 C24.1 L1.3 U26.1(-Vin)
$1N9139: CN3.6 R28.1
$1N10226: C23.2 CN2.2 F1.1
$1N10427: C18.1 C24.2 C25.1 L1.2 R30.1 U26.2(+Vin)
$1N12126: 5v_OK.1(A) R31.2
$1N12155: C16.2 C23.1 CN2.1 D7.1(K) L1.4
$1N12202: 24v_OK.1(A) R30.2
$1N17737: C22.2 D12.2 R28.2 U2.32(PD2(INT0/PCINT18))
$1N17752: U2.31(PD1(TXD/PCINT17)) U15.2
$1N20626: bttn_conn.2 R32.1 U2.13((PCINT1/OC1A)PB1)
$1N20631: bttn_conn.6 R36.1 U2.9((PCINT21/OC0B/T1)PD5)
$1N20634: bttn_conn.5 R35.1 U2.10((PCINT22/OC0A/AIN0)PD6)
$1N20640: bttn_conn.3 R33.1 U2.12((PCINT0/CLKO/ICP1)PB0)
$1N20643: bttn_conn.4 R34.1 U2.11((PCINT23/AIN1)PD7)
$1N25525: bttn.3 SW1.1 SW1.2
$1N25532: bttn.4 SW5.1 SW5.2
$1N25711: bttn.1 SW1.3 SW1.4 SW2.3 SW2.4 SW3.3 SW3.4 SW4.3 SW4.4 SW5.3 SW5.4
$1N25891: bttn.5 SW4.1 SW4.2
$1N25977: bttn.6 SW3.1 SW3.2
$1N26054: bttn.2 SW2.1 SW2.2
$2N1: C7.2 C19.1 CARD1.4(+3.3V) U3.2(+3.3V) U4.14(+3.3V) U24.2(A)
$2N9: CARD1.3(CMD) U4.3(1Y)
$2N10: CARD1.5(CLK) U4.6(2Y)
$2N11: CARD1.2(CD/DAT3) U4.8(3Y)
$2N12: CARD1.7(DAT0) R21.2
$2N13: R21.1 U4.12(4A)
$2N14: R19.2 U4.5(2A)
$2N15: R18.2 U4.2(1A)
$2N17: R20.2 U4.9(3A)
$3N912: R26.2 U23.4
$3N917: R26.1 U23.3
$3N985: R13.2 U22.2
$3N991: R14.1 U22.1
$3N4293: D9.3 D11.1 D11.2 U5.7(B) U22.4 U23.1 U27.1
$3N4296: CN4.1 U27.2
$3N4312: D9.1 D9.2 D10.1 D10.2 U5.6(A) U22.3 U23.2 U28.1
$3N4779: CN4.2 U28.2
$3N6044: CN5.3 R38.1 U29.1(SCL)
$3N6050: CN5.2 R37.1 U29.2(SDA)
$3N6057: C26.1 CN5.4 CN6.1 U29.5(A0) U29.9(VSS)
$3N6284: CN6.14 U29.19(GP7)
$3N6302: CN6.13 U29.18(GP6)
$3N6308: CN6.12 U29.17(GP5)
$3N6317: CN6.11 U29.16(GP4)
$3N6324: CN6.6 U29.14(GP2)
$3N6338: CN6.5 U29.13(GP1)
$3N6346: CN6.4 U29.12(GP0)
$3N6493: C26.2 CN5.1 CN6.2 R37.2 R38.2 U29.3(A2) U29.4(A1) U29.6(RESET#) U29.20(VDD)
Net-(C25-2): C25.2 D7.2(A) L1.1

Not connected (* = marked no-connect by the designer): CARD1 1(DAT2)* 8(DAT1)* 9(CD)*; CN6 3* 7* 8* 9* 10 15* 16*; F1 2; U2 19(ADC6)* 20(AREF)* 22(ADC7)* 23(PC0(ADC0/PCINT8))* 24(PC1(ADC1/PCINT9))* 25(PC2(ADC2/PCINT10))* 26(PC3(ADC3/PCINT11))*; U14 1*; U26 6(CTRL)*; U29 7(NC/2)* 8(INT)* 10(NC/3)* 11(NC)* 15(GP3)*

## Notes on the sheets
sheet 1
- UART area
- BTTNS_CONN
- DT
- RX
- TX
- VCC
- GND
- AVR ISP
- POWER SCHEME
- BUTTONS_CONN
- DISPLAY_CONN
sheet 3
- 200mV delta against small
  potential and potential debris
- Termination resistor
- TIA 485
- 200mV delta against small
  potential and potential debris
- Display_conn
- +5v
- sda
- scl
- gnd
